# Altium project WatchX_TEST.PrjPcb
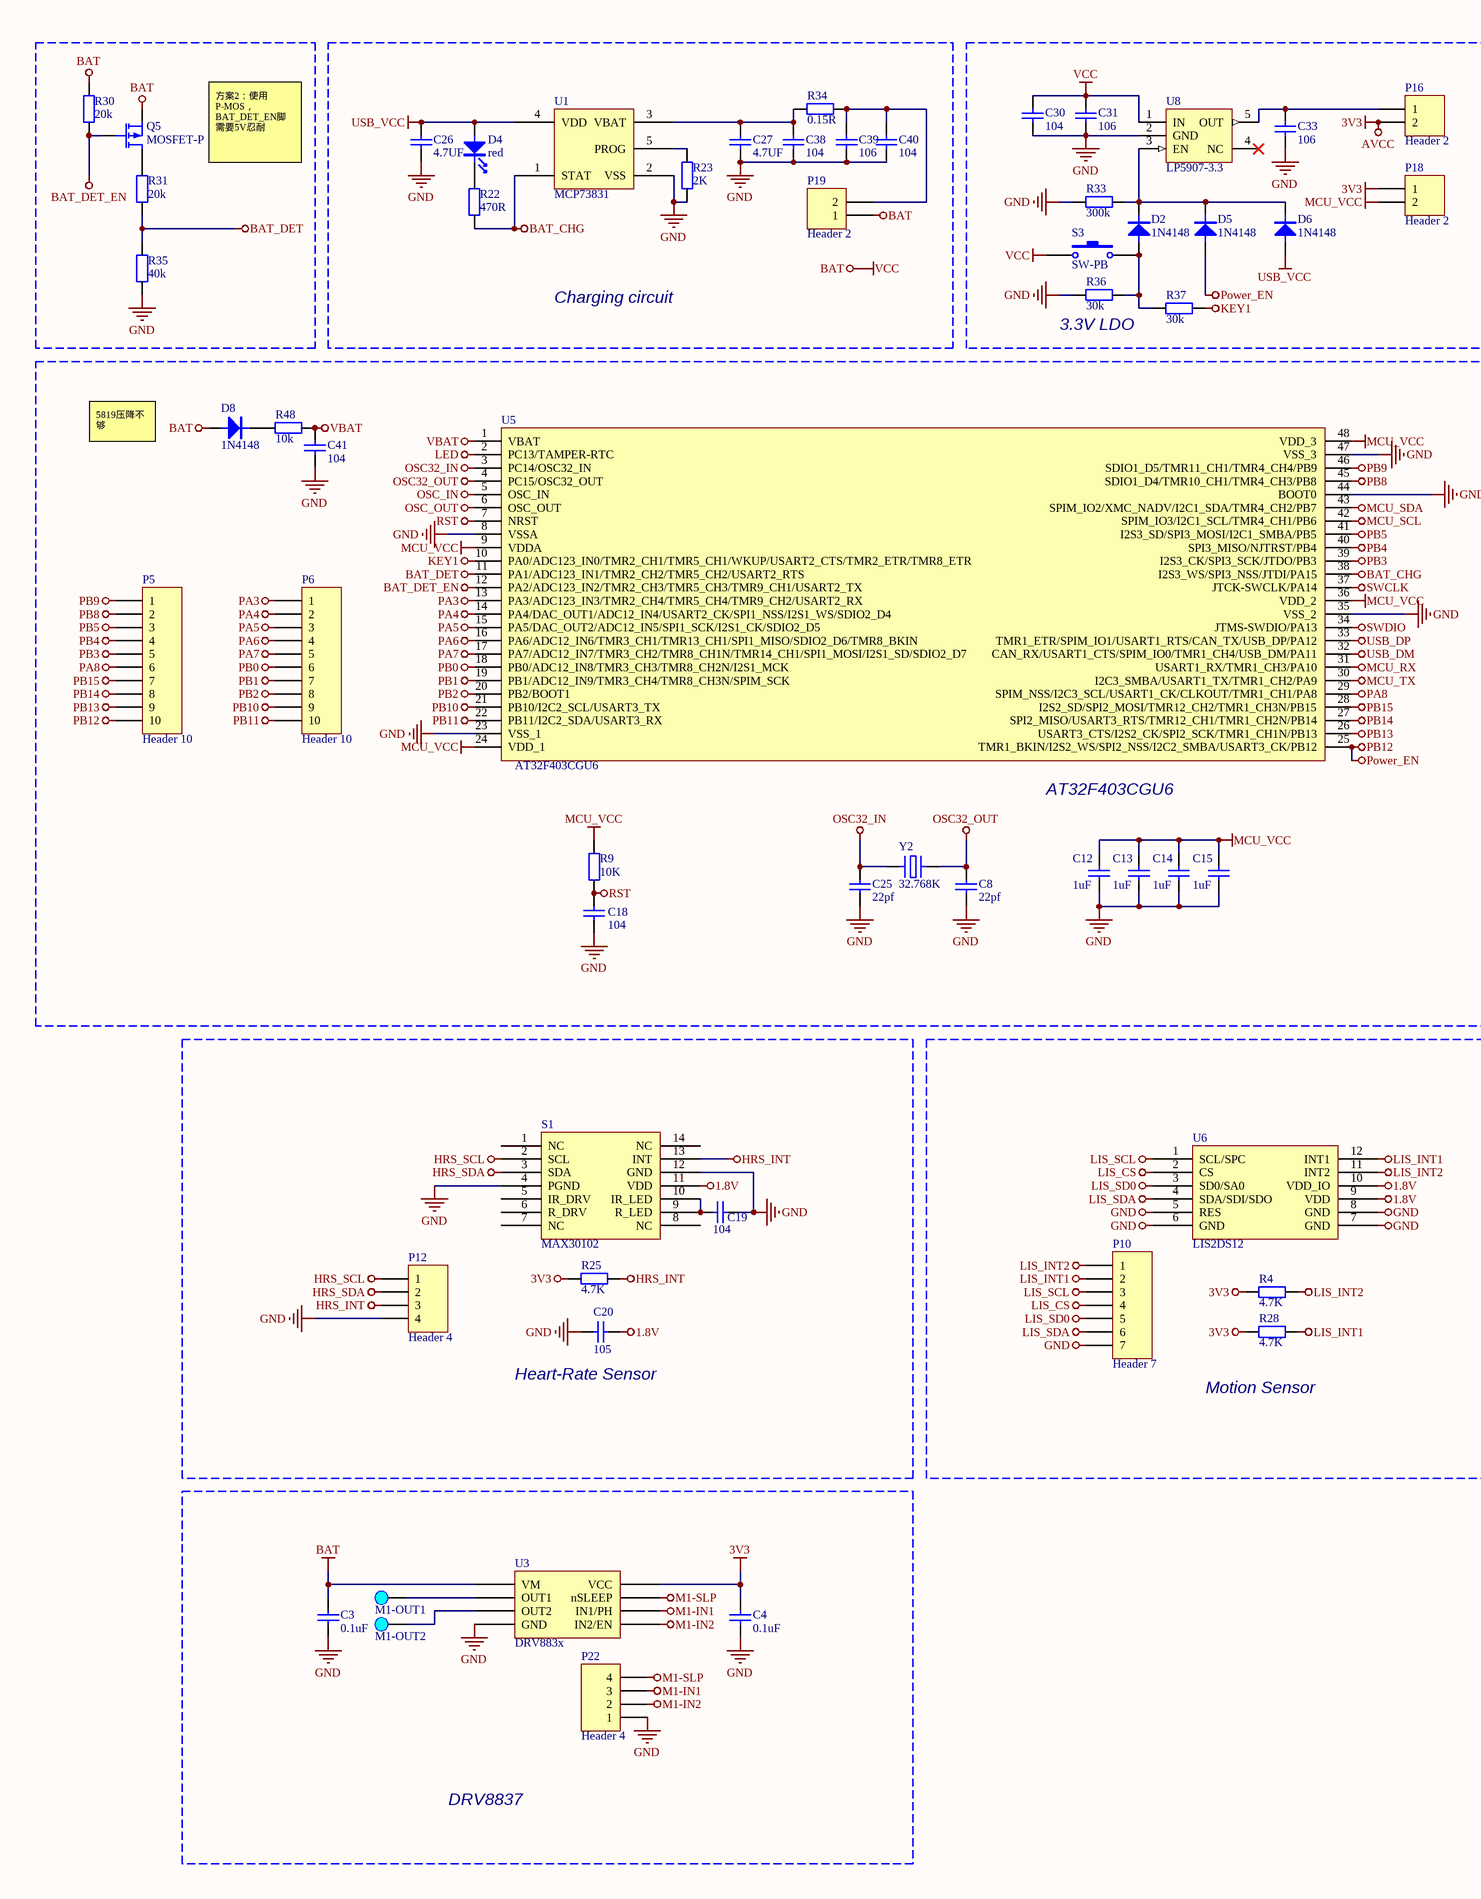
[diagram p0: WatchX_TEST.SchDoc, left]
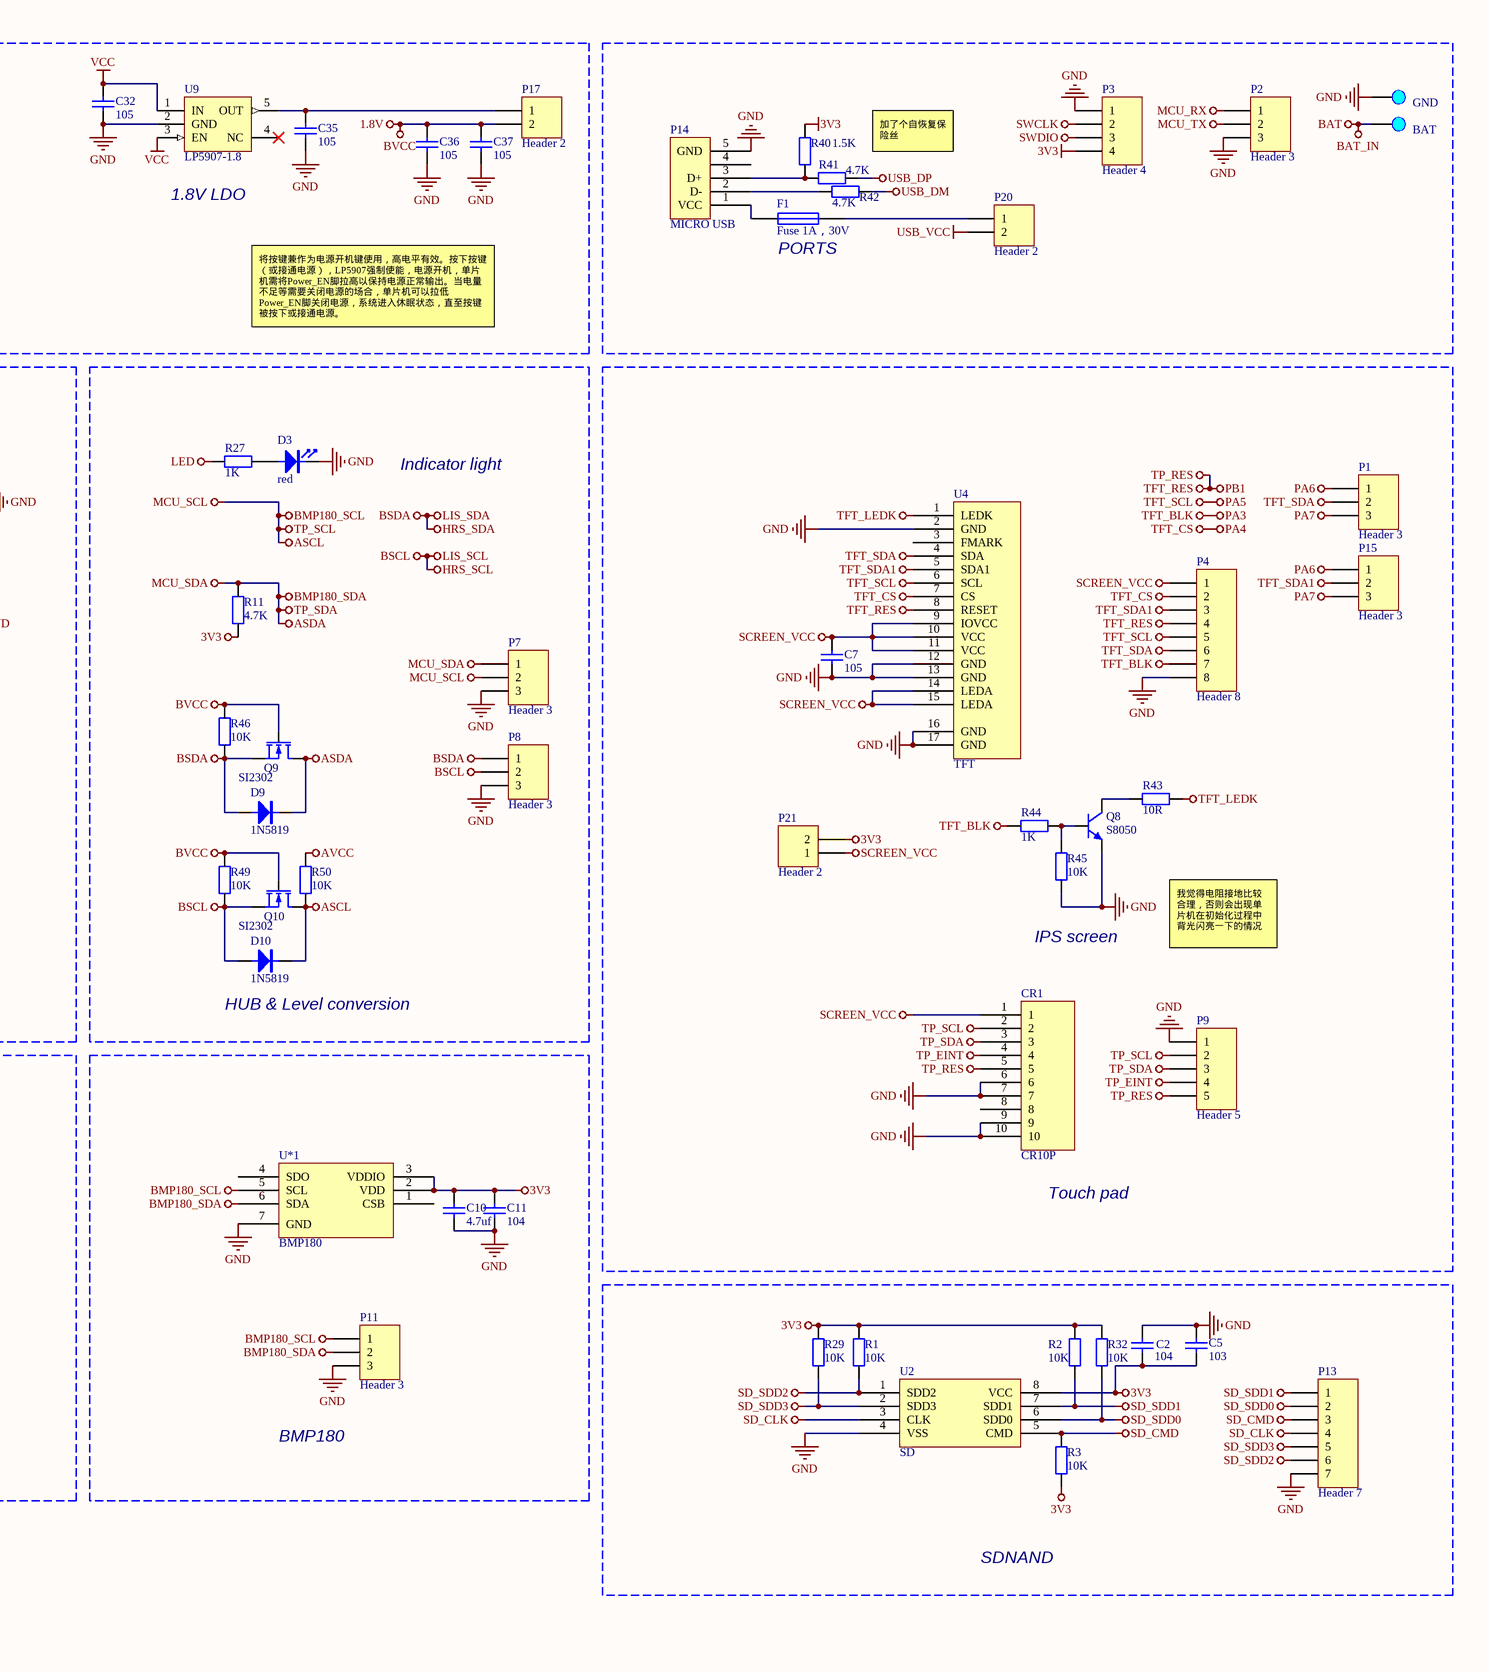
[diagram p1: WatchX_TEST.SchDoc, right]
1 sheet, 111 parts. Net scope: global (net labels, ports and power ports of the same name join across sheets).
Board file: WatchX_TEST.PcbDoc

## Sheet WatchX_TEST.SchDoc
size A2

### Parts
C2  104  [电容_C0603]
C3  0.1uF  [电容_C0603]
C4  0.1uF  [电容_C0603]
C5  103  [电容_C0603]
C7  105  [电容_C0603]
C8  22pf  [电容_C0603]
C10  4.7uf  [电容_C0603]
C11  104  [电容_C0603]
C12  1uF  [电容_C0603]
C13  1uF  [电容_C0603]
C14  1uF  [电容_C0603]
C15  1uF  [电容_C0603]
C18  104  [电容_C0603]
C19  104  [电容_C0603]
C20  105  [电容_C0603]
C25  22pf  [电容_C0603]
C26  4.7UF  [电容_C0805]
C27  4.7UF  [电容_C0805]
C30  104  [电容_C0603]
C31  106  [电容_C0603]
C32  105  [电容_C0603]
C33  106  [电容_C0603]
C35  105  [电容_C0603]
C36  105  [电容_C0603]
C37  105  [电容_C0603]
C38  104  [电容_C0603]
C39  106  [电容_C0805]
C40  104  [电容_C0603]
C41  104  [电容_C0603]
CR1  CR10P  [CONN RCPT 10POS 0.4MM]
D2  1N4148  [二极管_SOD-323]
D3  red  [LED_0603]
D4  red  [LED_0603]
D5  1N4148  [二极管_SOD-323]
D6  1N4148  [二极管_SOD-323]
D8  1N4148  [二极管_SOD-323]
D9  1N5819  [二极管_SOD-323]
D10  1N5819  [二极管_SOD-323]
F1  Fuse 1A，30V  [电阻_R0805]
M1+  M1-OUT1  [Pad_B]
M1-  M1-OUT2  [Pad_B]
P1  Header 3  [HDR1X3]
P2  Header 3  [HDR1X3]
P3  Header 4  [HDR1X4]
P4  Header 8  [HDR1X8]
P5  Header 10  [HDR1X10]
P6  Header 10  [HDR1X10]
P7  Header 3  [HDR1X3]
P8  Header 3  [HDR1X3]
P9  Header 5  [HDR1X5]
P10  Header 7  [HDR1X7]
P11  Header 3  [HDR1X3]
P12  Header 4  [HDR1X4]
P13  Header 7  [HDR1X7]
P14  MICRO USB  [接插件_MICRO 牛角插座 USB 卷边]
P15  Header 3  [HDR1X3]
P16  Header 2  [HDR1X2]
P17  Header 2  [HDR1X2]
P18  Header 2  [HDR1X2]
P19  Header 2  [HDR1X2]
P20  Header 2  [HDR1X2]
P21  Header 2  [HDR1X2]
P22  Header 4  [HDR1X4]
Pad1  GND  [Pad_A]
Pad6  BAT  [Pad_A]
Q5  MOSFET-P  [SOT23]
Q8  S8050  [三极管_SOT-23]
Q9  SI2302  [MOS_SOT-23]
Q10  SI2302  [MOS_SOT-23]
R1  10K  [电阻_R0603]
R2  10K  [电阻_R0603]
R3  10K  [电阻_R0603]
R4  4.7K  [电阻_R0603]
R9  10K  [电阻_R0603]
R11  4.7K  [电阻_R0603]
R22  470R  [电阻_R0603]
R23  2K  [电阻_R0603]
R25  4.7K  [电阻_R0603]
R27  1K  [电阻_R0603]
R28  4.7K  [电阻_R0603]
R29  10K  [电阻_R0603]
R30  20k  [电阻_R0603]
R31  20k  [电阻_R0603]
R32  10K  [电阻_R0603]
R33  300k  [电阻_R0603]
R34  0.15R  [电阻_R0603]
R35  40k  [电阻_R0603]
R36  30k  [电阻_R0603]
R37  30k  [电阻_R0603]
R40  1.5K  [电阻_R0603]
R41  4.7K  [电阻_R0603]
R42  4.7K  [电阻_R0603]
R43  10R  [电阻_R0603]
R44  1K  [电阻_R0603]
R45  10K  [电阻_R0603]
R46  10K  [电阻_R0603]
R48  10k  [电阻_R0603]
R49  10K  [电阻_R0603]
R50  10K  [电阻_R0603]
S1  MAX30102  [MAX30102]
S3  SW-PB  [KEY_8*8mm]
U1  MCP73831  [SOT23-5]
U2  SD  [LGA-8_6*8mm2]
U3  DRV883x  [WSON-8_2*2]
U4  TFT  [FPC-0.30mm-15P]
U5  AT32F403CGU6  [AT主控_QFN48(6X6)]
U6  LIS2DS12  [LGA-12_L2.0-W2.0-P0.50-BL]
U8  LP5907-3.3  [SOT23-5]
U9  LP5907-1.8  [SOT23-5]
U*1  BMP180  [LGA-7]
Y2  32.768K  [晶振_3215]

### Blocks framed on the sheet
Charging circuit: C26 C27 C38-C40 D4 P19 R22 R23 R34 U1
PORTS: F1 P2 P3 P14 P20 Pad1 Pad6 R40-R42
AT32F403CGU6: C8 C12-C15 C18 C25 C41 D8 P5 P6 R9 R48 U5 Y2
Heart-Rate Sensor: C19 C20 P12 R25 S1
Motion Sensor: P10 R4 R28 U6
BMP180: C10 C11 P11 U*1
SDNAND: C2 C5 P13 R1-R3 R29 R32 U2
DRV8837: C3 C4 M1+ M1- P22 U3

### Nets
1.8V: C20.1 C36.2 C37.2 P17.2 Q9.1(G) Q10.1(G) R46.1 R49.1 S1.11(VDD) U6.9(VDD) U6.10(VDD_IO)  [also labelled BVCC]
3V3: C2.1 C4.2 C5.1 C10.2 C11.2 P3.4 P16.2 P18.1 P21.2 R1.1 R2.1 R3.2 R4.2 R11.1 R25.2 R28.2 R29.1 R32.1 R40.2 R50.1 U2.8(VCC) U3.8(VCC) U*1.2(VDD) U*1.3(VDDIO)  [also labelled AVCC]
ASCL: CR1.2 D10.K P7.2 P9.2 P11.1 Q10.2(D) R50.2 U5.42(SPIM_IO3/I2C1_SCL/TMR4_CH1/PB6) U*1.5(SCL)  [also labelled BMP180_SCL, MCU_SCL, TP_SCL]
ASDA: CR1.3 D9.K P7.1 P9.3 P11.2 Q9.2(D) R11.2 U5.43(SPIM_IO2/XMC_NADV/I2C1_SDA/TMR4_CH2/PB7) U*1.6(SDA)  [also labelled BMP180_SDA, MCU_SDA, TP_SDA]
BAT: C3.1 C30.2 C31.2 C32.2 D8.A P19.1 Pad6.1 Q5.3(S) R30.2 S3.1 U3.1(VM) U8.1(IN) U9.1(IN) U9.3(EN)  [also labelled BAT_IN, VCC]
BAT_CHG: R22.1 U1.1(STAT) U5.38(I2S3_WS/SPI3_NSS/JTDI/PA15)
BAT_DET: R31.1 R35.2 U5.11(PA1/ADC123_IN1/TMR2_CH2/TMR5_CH2/USART2_RTS)
BAT_DET_EN: Q5.1(G) R30.1 U5.12(PA2/ADC123_IN2/TMR2_CH3/TMR5_CH3/TMR9_CH1/USART2_TX)
BSCL: D10.A P8.2 P10.3 P12.1 Q10.3(S) R49.2 S1.2(SCL) U6.1(SCL/SPC)  [also labelled HRS_SCL, LIS_SCL]
BSDA: D9.A P8.1 P10.6 P12.2 Q9.3(S) R46.2 S1.3(SDA) U6.4(SDA/SDI/SDO)  [also labelled HRS_SDA, LIS_SDA]
GND: C2.2 C3.2 C4.1 C5.2 C7.2 C8.2 C10.1 C11.1 C12.1 C13.1 C14.1 C15.1 C18.1 C19.1 C20.2 C25.2 C26.1 C27.1 C30.1 C31.1 C32.1 C33.1 C35.1 C36.1 C37.1 C38.2 C39.1 C40.2 C41.2 CR1.6 CR1.7 CR1.9 CR1.10 D3.K P2.3 P3.1 P4.8 P7.3 P8.3 P9.1 P10.7 P11.3 P12.4 P13.7 P14.0 P14.5(GND) P22.1 Pad1.1 Q8.3(E) R23.1 R33.2 R35.1 R36.2 R45.1 S1.4(PGND) S1.12(GND) U1.2(VSS) U2.4(VSS) U3.4(GND) U4.2(GND) U4.12(GND) U4.13(GND) U4.16(GND) U4.17(GND) U5.0(VSS) U5.8(VSSA) U5.23(VSS_1) U5.35(VSS_2) U5.44(BOOT0) U5.47(VSS_3) U6.5(RES) U6.6(GND) U6.7(GND) U6.8(GND) U8.2(GND) U9.2(GND) U*1.7(GND)
HRS_INT: P12.3 R25.1 S1.13(INT)
KEY1: R37.1 U5.10(PA0/ADC123_IN0/TMR2_CH1/TMR5_CH1/WKUP/USART2_CTS/TMR2_ETR/TMR8_ETR)
LED: R27.1 U5.2(PC13/TAMPER-RTC)
LIS_CS: P10.4 U6.2(CS)
LIS_INT1: P10.2 R28.1 U6.12(INT1)
LIS_INT2: P10.1 R4.1 U6.11(INT2)
LIS_SD0: P10.5 U6.3(SD0/SA0)
M1-IN1: P22.3 U3.6(IN1/PH)
M1-IN2: P22.2 U3.5(IN2/EN)
M1-SLP: P22.4 U3.7(nSLEEP)
MCU_RX: P2.1 U5.31(USART1_RX/TMR1_CH3/PA10)
MCU_TX: P2.2 U5.30(I2C3_SMBA/USART1_TX/TMR1_CH2/PA9)
MCU_VCC: C12.2 C13.2 C14.2 C15.2 P18.2 R9.2 U5.9(VDDA) U5.24(VDD_1) U5.36(VDD_2) U5.48(VDD_3)
OSC32_IN: C25.1 U5.3(PC14/OSC32_IN) Y2.1
OSC32_OUT: C8.1 U5.4(PC15/OSC32_OUT) Y2.2
OSC_IN: U5.5(OSC_IN)
OSC_OUT: U5.6(OSC_OUT)
PA3: P4.7 P6.1 R44.1 U5.13(PA3/ADC123_IN3/TMR2_CH4/TMR5_CH4/TMR9_CH2/USART2_RX)  [also labelled TFT_BLK]
PA4: P4.2 P6.2 U4.7(CS) U5.14(PA4/DAC_OUT1/ADC12_IN4/USART2_CK/SPI1_NSS/I2S1_WS/SDIO2_D4)  [also labelled TFT_CS]
PA5: P4.5 P6.3 U4.6(SCL) U5.15(PA5/DAC_OUT2/ADC12_IN5/SPI1_SCK/I2S1_CK/SDIO2_D5)  [also labelled TFT_SCL]
PA6: P1.1 P6.4 P15.1 U5.16(PA6/ADC12_IN6/TMR3_CH1/TMR13_CH1/SPI1_MISO/SDIO2_D6/TMR8_BKIN)
PA7: P1.3 P6.5 P15.3 U5.17(PA7/ADC12_IN7/TMR3_CH2/TMR8_CH1N/TMR14_CH1/SPI1_MOSI/I2S1_SD/SDIO2_D7)
PA8: P5.6 U5.29(SPIM_NSS/I2C3_SCL/USART1_CK/CLKOUT/TMR1_CH1/PA8)
PB0: P6.6 U5.18(PB0/ADC12_IN8/TMR3_CH3/TMR8_CH2N/I2S1_MCK)
PB1: CR1.5 P4.4 P6.7 P9.5 U4.8(RESET) U5.19(PB1/ADC12_IN9/TMR3_CH4/TMR8_CH3N/SPIM_SCK)  [also labelled TFT_RES, TP_RES]
PB2: P6.8 U5.20(PB2/BOOT1)
PB3: P5.5 U5.39(I2S3_CK/SPI3_SCK/JTDO/PB3)
PB4: P5.4 U5.40(SPI3_MISO/NJTRST/PB4)
PB5: P5.3 U5.41(I2S3_SD/SPI3_MOSI/I2C1_SMBA/PB5)
PB8: P5.2 U5.45(SDIO1_D4/TMR10_CH1/TMR4_CH3/PB8)
PB9: P5.1 U5.46(SDIO1_D5/TMR11_CH1/TMR4_CH4/PB9)
PB10: P6.9 U5.21(PB10/I2C2_SCL/USART3_TX)
PB11: P6.10 U5.22(PB11/I2C2_SDA/USART3_RX)
PB12: D5.A P5.10 U5.25(TMR1_BKIN/I2S2_WS/SPI2_NSS/I2C2_SMBA/USART3_CK/PB12)  [also labelled Power_EN]
PB13: P5.9 U5.26(USART3_CTS/I2S2_CK/SPI2_SCK/TMR1_CH1N/PB13)
PB14: P5.8 U5.27(SPI2_MISO/USART3_RTS/TMR12_CH1/TMR1_CH2N/PB14)
PB15: P5.7 U5.28(I2S2_SD/SPI2_MOSI/TMR12_CH2/TMR1_CH3N/PB15)
RST: C18.2 R9.1 U5.7(NRST)
SCREEN_VCC: C7.1 CR1.1 P4.1 P21.1 U4.9(IOVCC) U4.10(VCC) U4.11(VCC) U4.14(LEDA) U4.15(LEDA)
SD_CLK: P13.4 U2.3(CLK)
SD_CMD: P13.3 R3.1 U2.5(CMD)
SD_SDD0: P13.2 R32.2 U2.6(SDD0)
SD_SDD1: P13.1 R2.2 U2.7(SDD1)
SD_SDD2: P13.6 R1.2 U2.1(SDD2)
SD_SDD3: P13.5 R29.2 U2.2(SDD3)
SWCLK: P3.2 U5.37(JTCK-SWCLK/PA14)
SWDIO: P3.3 U5.34(JTMS-SWDIO/PA13)
TFT_LEDK: R43.2 U4.1(LEDK)
TFT_SDA: P1.2 P4.6 U4.4(SDA)
TFT_SDA1: P4.3 P15.2 U4.5(SDA1)
TP_EINT: CR1.4 P9.4
USB_DM: R42.2 U5.32(CAN_RX/USART1_CTS/SPIM_IO0/TMR1_CH4/USB_DM/PA11)
USB_DP: R41.2 U5.33(TMR1_ETR/SPIM_IO1/USART1_RTS/CAN_TX/USB_DP/PA12)
USB_VCC: C26.2 D4.A D6.A P20.2 U1.4(VDD)
VBAT: C41.1 R48.1 U5.1(VBAT)
NetC19_2: C19.2 S1.9(R_LED) S1.10(IR_LED)
NetC27_2: C27.2 C38.1 R34.2 U1.3(VBAT)
NetC33_2: C33.2 P16.1 U8.5(OUT)
NetC35_2: C35.2 P17.1 U9.5(OUT)
NetC39_2: C39.2 C40.1 P19.2 R34.1
NetD2_A: D2.A R36.1 R37.2 S3.2
NetD2_K: D2.K D5.K D6.K R33.1 U8.3(EN)
NetD3_A: D3.A R27.2
NetD4_K: D4.K R22.2
NetD8_K: D8.K R48.2
NetF1_1: F1.1 P14.1(VCC)
NetF1_2: F1.2 P20.1
NetM1+_1: M1+.1 U3.2(OUT1)
NetM1-_1: M1-.1 U3.3(OUT2)
NetP14_2: P14.2(D-) R42.1
NetP14_3: P14.3(D+) R40.1 R41.1
NetQ5_2: Q5.2(D) R31.2
NetQ8_1: Q8.1(B) R44.2 R45.2
NetQ8_2: Q8.2(C) R43.1
NetR23_2: R23.2 U1.5(PROG)

Not connected (* = marked no-connect by the designer): CR1 8; P14 4; S1 1(NC) 5(IR_DRV) 6(R_DRV) 7(NC) 8(NC) 14(NC); U4 3(FMARK); U8 4(NC)*; U9 4(NC)*; U*1 1(CSB) 4(SDO)

### Notes on the sheet
- 方案2：使用P-MOS，BAT_DET_EN脚需要5V忍耐
- 加了个自恢复保险丝
- (near U9) 1.8V LDO
- (near R36) 3.3V LDO
- 将按键兼作为电源开机键使用，高电平有效。按下按键（或接通电源），LP5907强制使能，电源开机，单片机需将Power_EN脚拉高以保持电源正常输出。当电量不足等需要关闭电源的场合，单片机可以拉低Power_EN脚关闭电源，系统进入休眠状态，直至按键被按下或接通电源。
- 5819压降不够
- Indicator light
- IPS screen
- 我觉得电阻接地比较合理，否则会出现单片机在初始化过程中背光闪亮一下的情况
- (near D10) HUB & Level conversion
- 场效应管应并联肖特基二极管，否则低电平电压不够低。
- Touch pad

### Library data of the parts
C2-C5 C7 C8 C10-C15 C18-C20 C25-C27 C30-C33 C35-C41 = cap: U: 50V; 参数: Cap,0805,X7R,104K,50V,125C,±10%
  C2 C11 C18 C19 C30 C38 C40 C41: C: 104
  C3 C4: C: 0.1uF
  C5: C: 103
  C7 C20 C32 C35-C37: C: 105
  C8 C25: C: 22pf
  C10: C: 4.7uf
  C12-C15: C: 1uF
  C26 C27: C: 4.7UF
  C31 C33 C39: C: 106
CR1 = CONN RCPT 10P: 板对板连接器
D2 D5 D6 D8 = Diode: _Specification: Diode,1N4148,SOD-323,1A,40V; _Comma: ,; _Footprint: SOD-323; _Voltage: 40V; _Current: 1A; _Name: Diode; _Model: 1N4148
D3 D4 = LED: 参数: LED,0603,Red
D9 D10 = Diode: _Specification: Diode,1N5819,SOD-323,1A,40V; _Comma: ,; _Footprint: SOD-323; _Voltage: 40V; _Current: 1A; _Name: Diode; _Model: 1N5819
F1 = Fuse 1: Fuse; Published: 8-Jun-2000; LatestRevisionDate: 17-Jul-2002; LatestRevisionNote: Re-released for DXP Platform.; PackageReference: PIN-W2/E2.8; Publisher: Altium Limited; PackageDescription: Thru-Hole; 2 Leads
M1+ = Pad: _Funcyusa: Test; _Specification: Pad,Test,M1-OUT1; _Comma: ,; _Name: Pad; _Remarks: M1-OUT1
M1- = Pad: _Funcyusa: Test; _Specification: Pad,Test,M1-OUT2; _Comma: ,; _Name: Pad; _Remarks: M1-OUT2
P1 P2 P7 P8 P11 P15 = Header 3: Header, 3-Pin; LatestRevisionDate: 17-Jul-2002; LatestRevisionNote: Re-released for DXP Platform.; Publisher: Altium Limited
P3 P12 P22 = Header 4: Header, 4-Pin; LatestRevisionDate: 17-Jul-2002; LatestRevisionNote: Re-released for DXP Platform.; Publisher: Altium Limited
P4 = Header 8: Header, 8-Pin; LatestRevisionDate: 17-Jul-2002; LatestRevisionNote: Re-released for DXP Platform.; Publisher: Altium Limited
P5 P6 = Header 10: Header, 10-Pin; LatestRevisionDate: 17-Jul-2002; LatestRevisionNote: Re-released for DXP Platform.; Publisher: Altium Limited
P9 = Header 5: Header, 5-Pin; LatestRevisionDate: 17-Jul-2002; LatestRevisionNote: Re-released for DXP Platform.; Publisher: Altium Limited
P10 P13 = Header 7: Header, 7-Pin; LatestRevisionDate: 17-Jul-2002; LatestRevisionNote: Re-released for DXP Platform.; Publisher: Altium Limited
P14 = MICRO USB 5PIN: _Comma: ,; _Name: Port; _Specification: Port,MICRO USB,5PIN; _Value: 5PIN; _Model: MICRO USB
P16-P21 = Header 2: Header, 2-Pin; LatestRevisionDate: 17-Jul-2002; LatestRevisionNote: Re-released for DXP Platform.; Publisher: Altium Limited
Pad1 = Pad: _Funcyusa: Test; _Specification: Pad,Test,GND; _Comma: ,; _Name: Pad; _Remarks: GND
Pad6 = Pad: _Funcyusa: Test; _Specification: Pad,Test,BAT; _Comma: ,; _Name: Pad; _Remarks: BAT
Q5 = MOSFET-P: P-Channel MOSFET; Published: 8-Jun-2000; LatestRevisionDate: 17-Jul-2002; LatestRevisionNote: Re-released for DXP Platform.; PackageVersion: 1995/1996; PackageReference: E3; Publisher: Altium Limited; PackageDescription: TO, Flat Index; 3 In-Line, Axial Leads; Body Dia. 4.6mm; Lead Dia. 0.5 mm (max)
Q8 = Triode-NPN: _Comma: ,; _Current: 500mA; _Footprint: SOT-23; _Name: Triode; _Specification: Triode,NPN,S8050,SOT-23,500mA,40V; _Voltage: 40V; _Polarity: NPN; _Model: S8050
Q9 Q10 = MOSFET-N: _Comma: ,; _Current: 150A; _Footprint: DFN5*6; _Name: N-MOSFET; _Specification: N-MOSFET,SI2302,DFN5*6,150A,30V; _Voltage: 30V; _Model: SI2302
R1-R4 R9 R11 R22 R23 R25 R27-R37 R40-R42 R46 R48-R50 = Res: P: 1/8W; 参数: Res,0805,0R,±1%,1/8W,100ppm,155C
  R1-R3 R9 R29 R32 R46 R49 R50: R: 10K
  R4 R11 R25 R28 R41 R42: R: 4.7K
  R22: R: 470R
  R23: R: 2K
  R27: R: 1K
  R30 R31: R: 20k
  R33: R: 300k
  R34: R: 0.15R
  R35: R: 40k
  R36 R37: R: 30k
  R40: R: 1.5K
  R48: R: 10k
R43 = Res: _Accuracy: 1%; _Power: 1/8W; _Footprint: 0805; _Drift: 100ppm; _Comma: ,; _Specification: Res,0805,10R,1%,1/8W,100ppm; _Name: Res; _Value: 10R
R44 = Res: _Accuracy: 1%; _Power: 1/8W; _Footprint: 0805; _Drift: 100ppm; _Comma: ,; _Specification: Res,0805,1K,1%,1/8W,100ppm; _Name: Res; _Value: 1K
R45 = Res: _Accuracy: 1%; _Power: 1/8W; _Footprint: 0805; _Drift: 100ppm; _Comma: ,; _Specification: Res,0805,10K,1%,1/8W,100ppm; _Name: Res; _Value: 10K
S1 = MAX30102: 血氧浓度传感器
S3 = SW-PB: 按键
U1 = MCP73831: 线性充电管理控制器
U2 = SDNAND
U4 = TFT_IPS1-1.54寸240*240-AML015410V1: IPS电容式触摸屏
U5 = AT32F403CGU6: _Footprint: QFN48; _Comma: ,; _Name: MCU; _Specification: MCU,AT32F403CGU6,QFN48; _Model: AT32F403CGU6
U6 = LIS2DS12: 运动传感器
U8 U9 = LP5907: LDO
U*1 = BMP180: 数字气压传感器
Y2 = XTAL_A: _Name: CRYSTALS; _Comma: ,; _Specification: CRYSTALS,32.768K,*,10ppm,12pF; _Accuracy: 10ppm; _CL: 12pF; _Footprint: *; _Frequency: 32.768K